# EAGLE schematic mbed 6LoWPAN Border Router HAT (EAGLE 7.6.0)

## Sheet 1 of 4
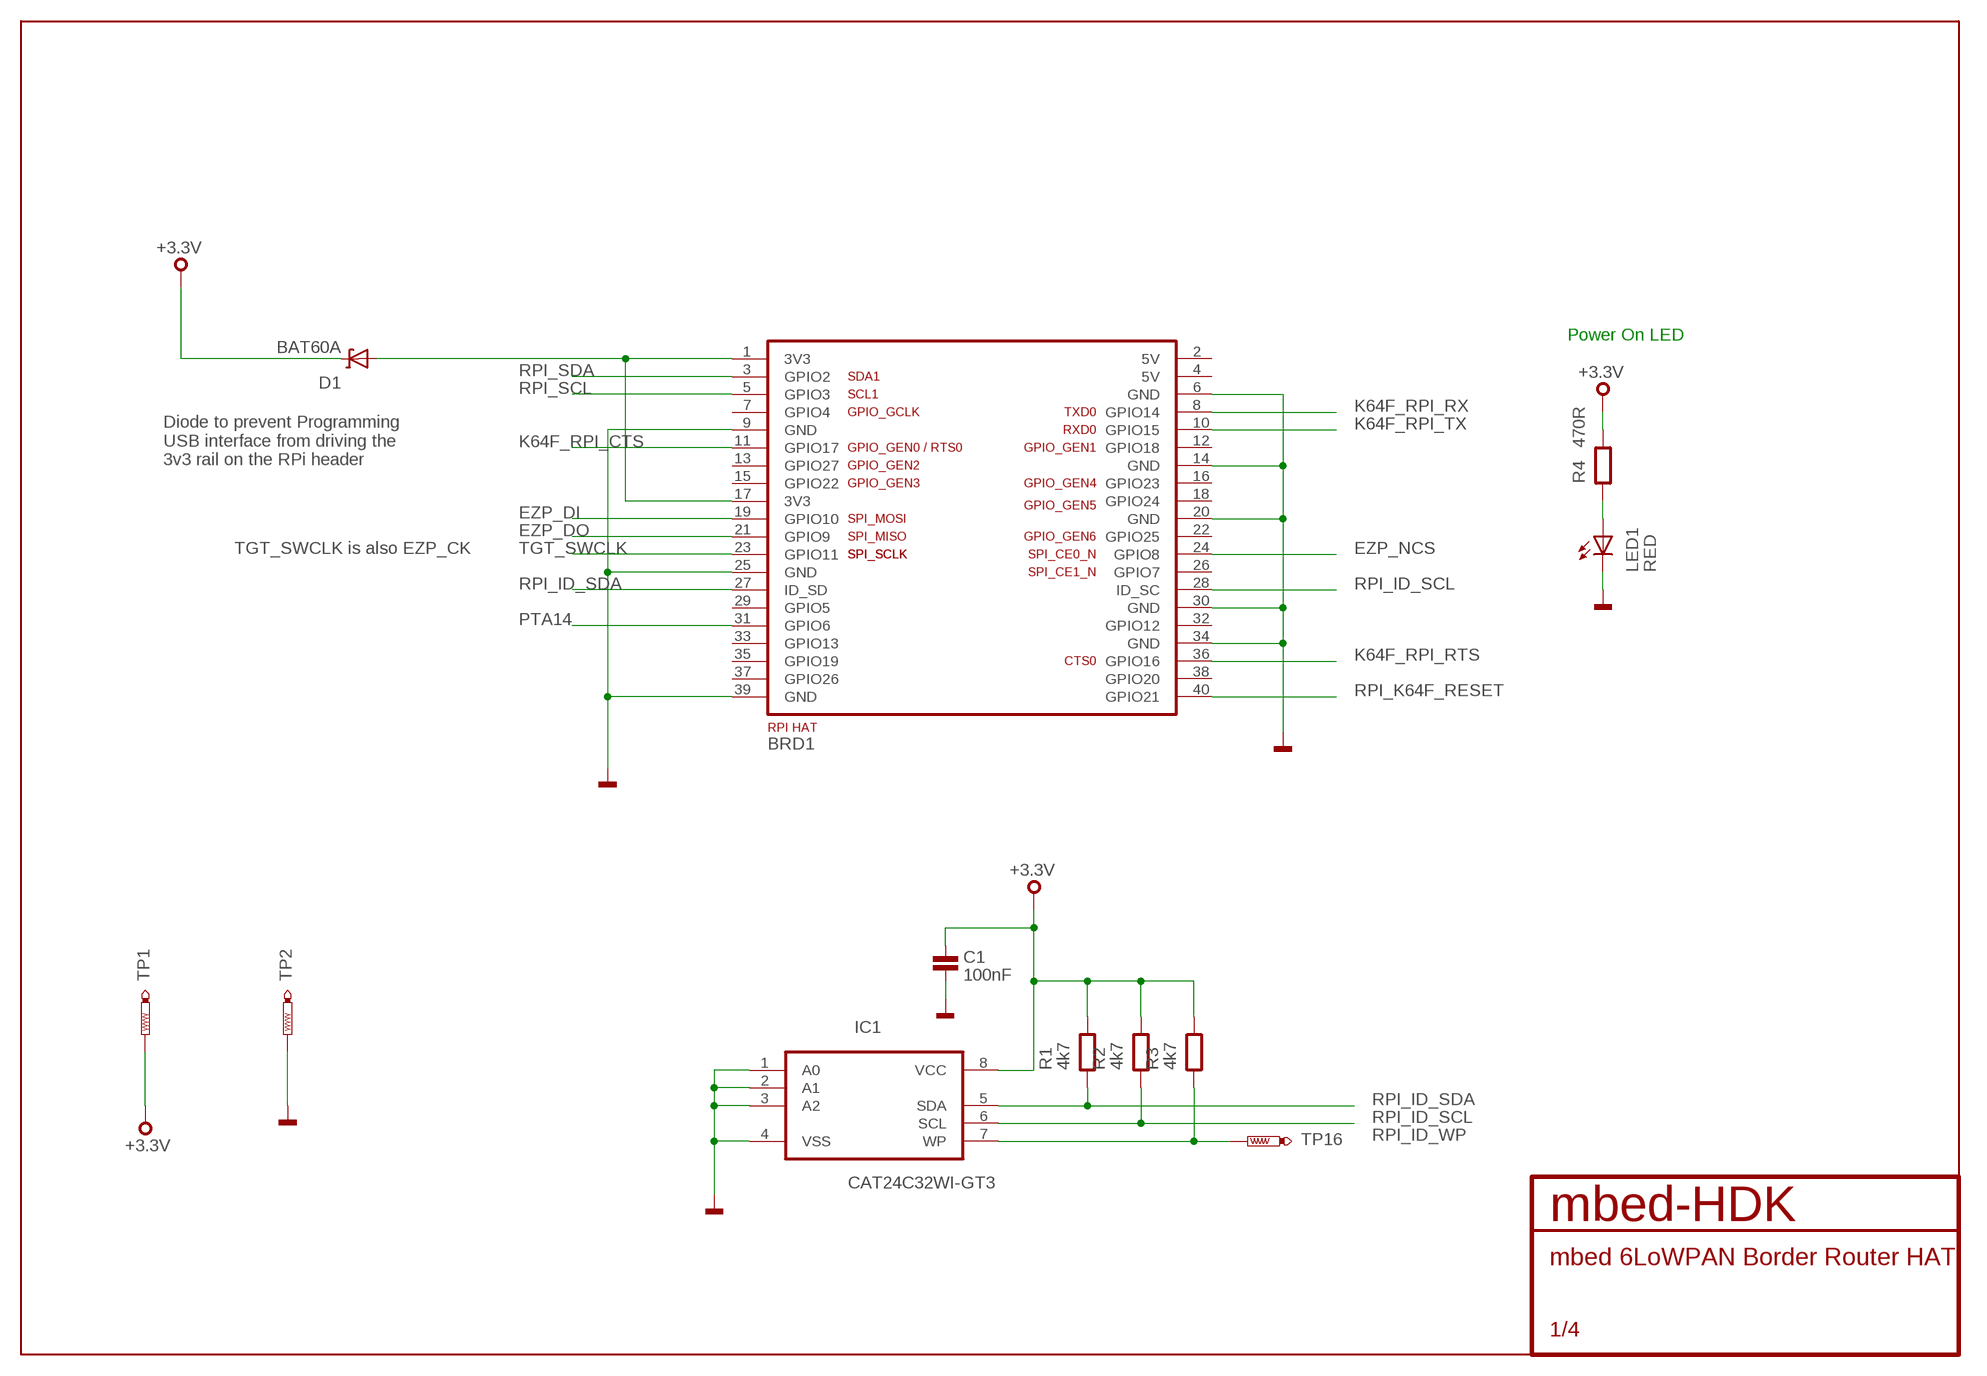
[diagram p0: schematic, sheet 1]

### Parts
BRD1  RPI-HAT  [RPI-HAT]
C1  100nF  C0402  [0402]
D1  BAT60A  [SOD323]
IC1  CAT24C32WI-GT3  [SOIC127P600X175-8N]
LED1  RED  LED0603  [CHIPLED_0603]
R1  4k7  R0402  [0402]
R2  4k7  R0402  [0402]
R3  4k7  R0402  [0402]
R4  470R  R0402  [0402]
TP1  TEST-POINT-50R-PTH  [TP50-PTH]
TP2  TEST-POINT-50R-PTH  [TP50-PTH]
TP16  TEST-POINT-50R-PTH  [TP50-PTH]

### Nets
+3.3V: C1.1 D1.K IC1.8(VCC) R1.2 R2.2 R3.2 R4.2 TP1.TP ; also sheet 2,3,4
EZP_DI: BRD1.19(GPIO10) ; also sheet 2
EZP_DO: BRD1.21(GPIO9) ; also sheet 2
EZP_NCS: BRD1.24(GPIO8) ; also sheet 2
GND: BRD1.6(GND) BRD1.9(GND) BRD1.14(GND) BRD1.20(GND) BRD1.25(GND) BRD1.30(GND) BRD1.34(GND) BRD1.39(GND) C1.2 IC1.1(A0) IC1.2(A1) IC1.3(A2) IC1.4(VSS) LED1.C TP2.TP ; also sheet 2,3,4
K64F_RPI_CTS: BRD1.11(GPIO17) ; also sheet 2
K64F_RPI_RTS: BRD1.36(GPIO16) ; also sheet 2
K64F_RPI_RX: BRD1.8(GPIO14) ; also sheet 2
K64F_RPI_TX: BRD1.10(GPIO15) ; also sheet 2
N$1: BRD1.1(3V3) BRD1.17(3V3) D1.A
N$17: LED1.A R4.1
PTA14: BRD1.31(GPIO6) ; also sheet 2
RPI_ID_SCL: BRD1.28(ID_SC) IC1.6(SCL) R2.1
RPI_ID_SDA: BRD1.27(ID_SD) IC1.5(SDA) R1.1
RPI_ID_WP: IC1.7(WP) R3.1 TP16.TP
RPI_K64F_RESET: BRD1.40(GPIO21) ; also sheet 2
RPI_SCL: BRD1.5(GPIO3) ; also sheet 2
RPI_SDA: BRD1.3(GPIO2) ; also sheet 2
TGT_SWCLK: BRD1.23(GPIO11) ; also sheet 2,4
Unconnected: BRD1.2(5V) BRD1.4(5V) BRD1.7(GPIO4) BRD1.12(GPIO18) BRD1.13(GPIO27) BRD1.15(GPIO22) BRD1.16(GPIO23) BRD1.18(GPIO24) BRD1.22(GPIO25) BRD1.26(GPIO7) BRD1.29(GPIO5) BRD1.32(GPIO12) BRD1.33(GPIO13) BRD1.35(GPIO19) BRD1.37(GPIO26) BRD1.38(GPIO20)

### Notes on the sheet
- Power On LED
- Diode to prevent Programming
  USB interface from driving the
  3v3 rail on the RPi header
- TGT_SWCLK is also EZP_CK

## Sheet 2 of 4
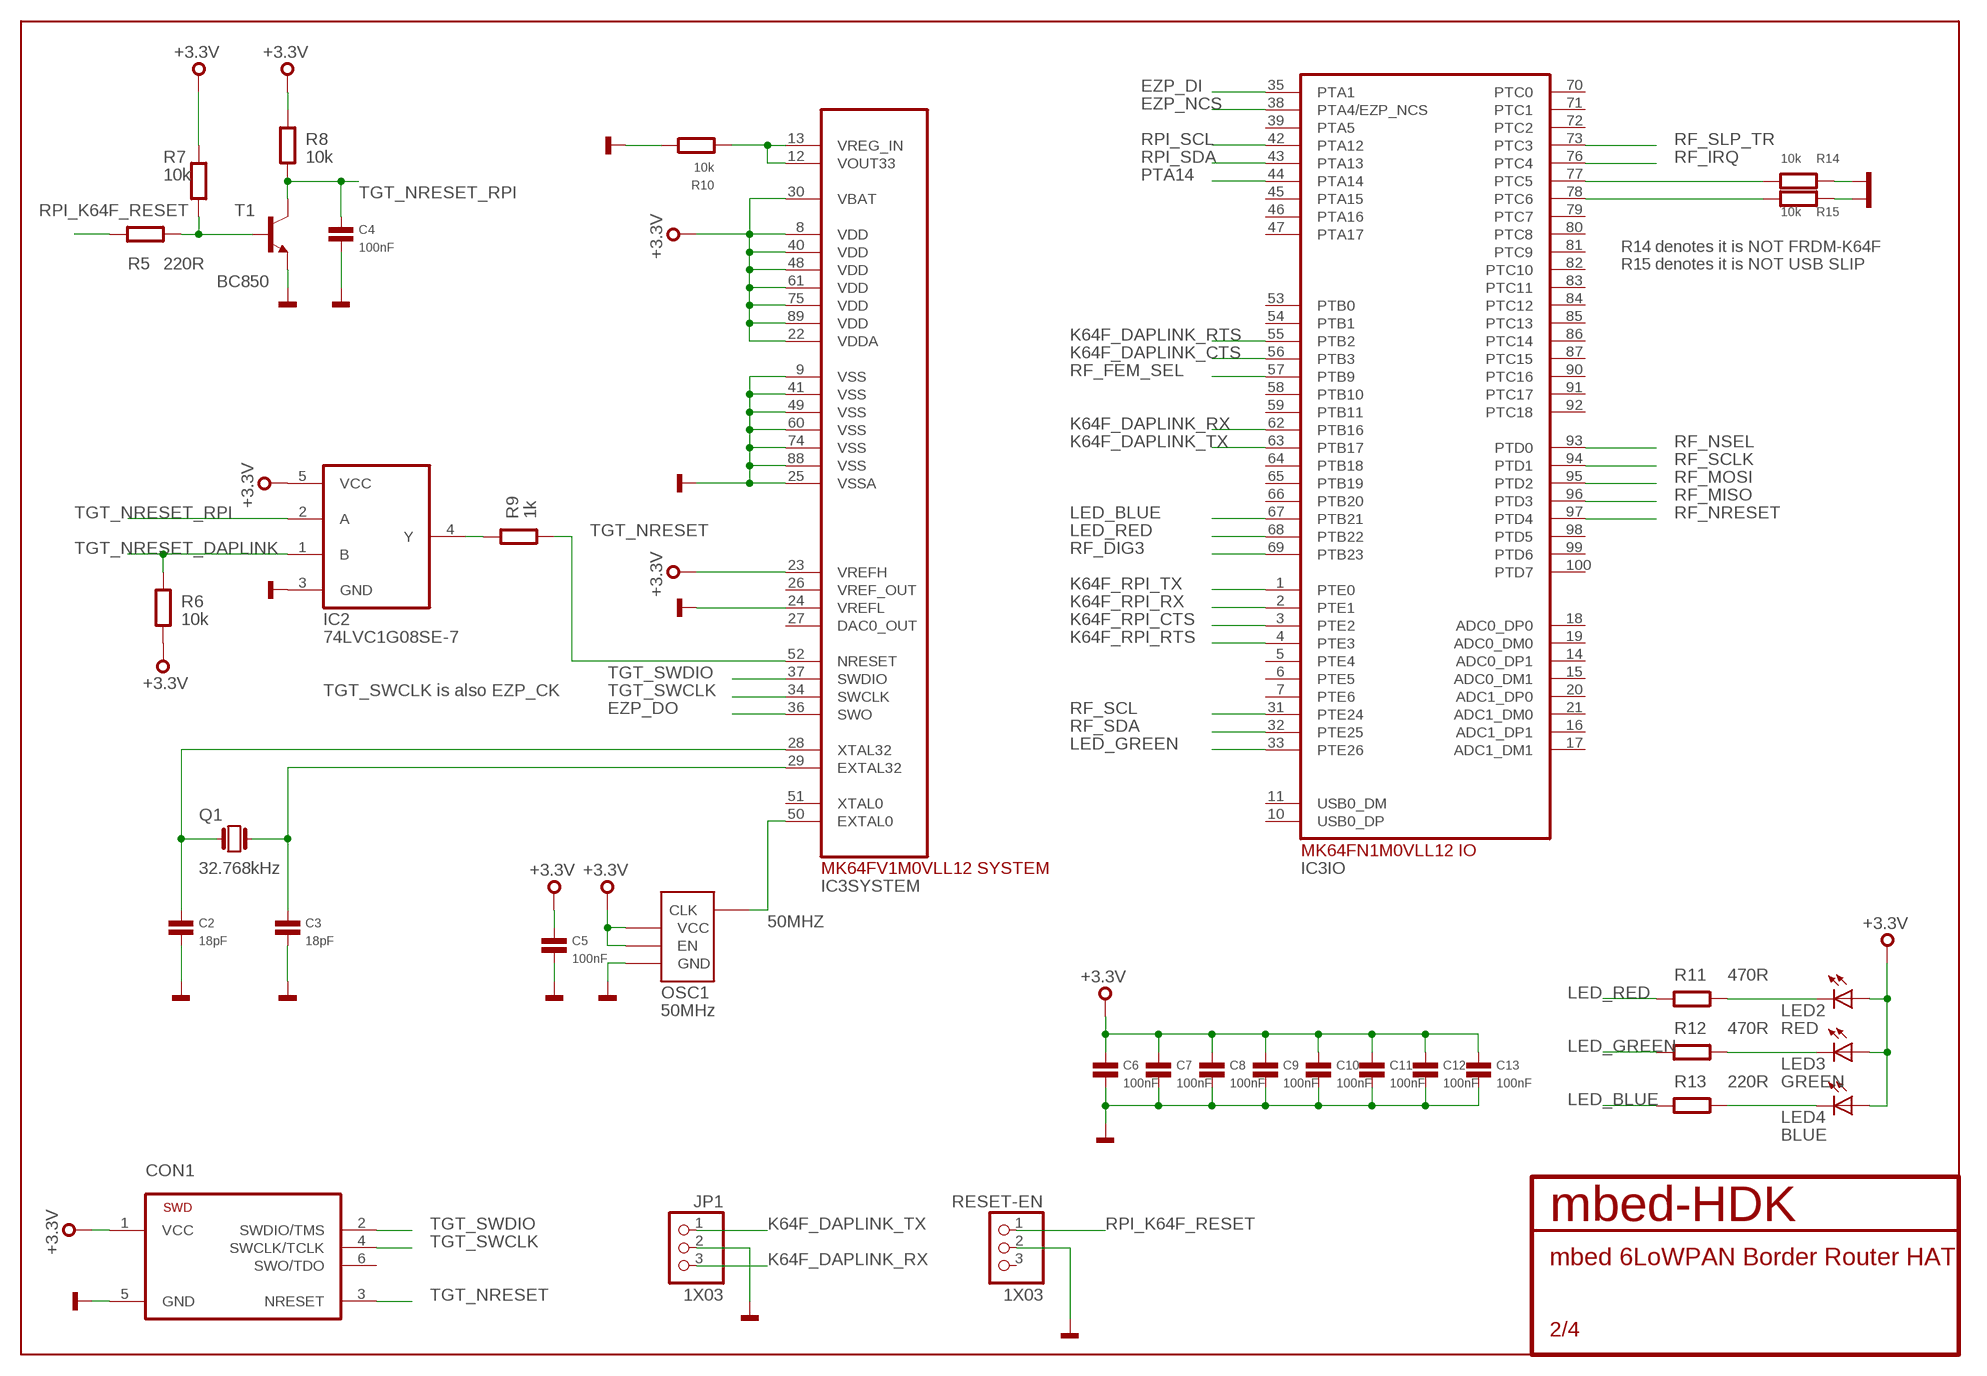
[diagram p1: schematic, sheet 2]

### Parts
C2  18pF  C0402  [0402]
C3  18pF  C0402  [0402]
C4  100nF  C0402  [0402]
C5  100nF  C0402  [0402]
C6  100nF  C0402  [0402]
C7  100nF  C0402  [0402]
C8  100nF  C0402  [0402]
C9  100nF  C0402  [0402]
C10  100nF  C0402  [0402]
C11  100nF  C0402  [0402]
C12  100nF  C0402  [0402]
C13  100nF  C0402  [0402]
CON1  TC2030-CTX-NL  [TC2030-CTX-NL]
IC2  74LVC1G08SE-7  74LVC1GXX  [SOT353]
IC3  MK64FN1M0VLL12  [LQFP100]
JP1  1X03  PINHD-1X3  [1X03]
LED2  RED  LED0603  [CHIPLED_0603]
LED3  GREEN  LED0603  [CHIPLED_0603]
LED4  BLUE  LED0603  [CHIPLED_0603]
OSC1  50MHz  OSCILLATOR3.2X2.5  [3.2X.2.5]
Q1  32.768kHz  Q_FC135  [FC135]
R5  220R  R0402  [0402]
R6  10k  R0402  [0402]
R7  10k  R0402  [0402]
R8  10k  R0402  [0402]
R9  1k  R0402  [0402]
R10  10k  R0402  [0402]
R11  470R  R0402  [0402]
R12  470R  R0402  [0402]
R13  220R  R0402  [0402]
R14  10k  R0402  [0402]
R15  10k  R0402  [0402]
RESET-EN  1X03  PINHD-1X3  [1X03]
T1  BC850  [SOT23]

### Nets
50MHZ: IC3.50(SYSTEM:EXTAL0) OSC1.P$3(CLK)
+3.3V: C5.1 C6.1 C7.1 C8.1 C9.1 C10.1 C11.1 C12.1 C13.1 CON1.1(VCC) IC2.5(VCC) IC3.8(SYSTEM:VDD) IC3.22(SYSTEM:VDDA) IC3.23(SYSTEM:VREFH) IC3.30(SYSTEM:VBAT) IC3.40(SYSTEM:VDD) IC3.48(SYSTEM:VDD) IC3.61(SYSTEM:VDD) IC3.75(SYSTEM:VDD) IC3.89(SYSTEM:VDD) LED2.A LED3.A LED4.A OSC1.P$1(EN) OSC1.P$4(VCC) R6.1 R7.1 R8.2 ; also sheet 1,3,4
EZP_DI: IC3.35(IO:PTA1) ; also sheet 1
EZP_DO: IC3.36(SYSTEM:SWO) ; also sheet 1
EZP_NCS: IC3.38(IO:PTA4/EZP_NCS) ; also sheet 1
GND: C2.2 C3.2 C4.2 C5.2 C6.2 C7.2 C8.2 C9.2 C10.2 C11.2 C12.2 C13.2 CON1.5(GND) IC2.3(GND) IC3.9(SYSTEM:VSS) IC3.24(SYSTEM:VREFL) IC3.25(SYSTEM:VSSA) IC3.41(SYSTEM:VSS) IC3.49(SYSTEM:VSS) IC3.60(SYSTEM:VSS) IC3.74(SYSTEM:VSS) IC3.88(SYSTEM:VSS) JP1.2 OSC1.P$2(GND) R10.2 R14.2 R15.2 RESET-EN.2 T1.2(E) ; also sheet 1,3,4
K64F_DAPLINK_CTS: IC3.56(IO:PTB3) ; also sheet 4
K64F_DAPLINK_RTS: IC3.55(IO:PTB2) ; also sheet 4
K64F_DAPLINK_RX: IC3.62(IO:PTB16) JP1.3 ; also sheet 4
K64F_DAPLINK_TX: IC3.63(IO:PTB17) JP1.1 ; also sheet 4
K64F_RPI_CTS: IC3.3(IO:PTE2) ; also sheet 1
K64F_RPI_RTS: IC3.4(IO:PTE3) ; also sheet 1
K64F_RPI_RX: IC3.2(IO:PTE1) ; also sheet 1
K64F_RPI_TX: IC3.1(IO:PTE0) ; also sheet 1
LED_BLUE: IC3.67(IO:PTB21) R13.1
LED_GREEN: IC3.33(IO:PTE26) R12.1
LED_RED: IC3.68(IO:PTB22) R11.1
N$2: C2.1 IC3.28(SYSTEM:XTAL32) Q1.X1
N$3: C3.1 IC3.29(SYSTEM:EXTAL32) Q1.X2
N$4: IC3.77(IO:PTC5) R14.1
N$6: IC3.12(SYSTEM:VOUT33) IC3.13(SYSTEM:VREG_IN) R10.1
N$8: LED2.C R11.2
N$9: LED3.C R12.2
N$10: LED4.C R13.2
N$14: R5.1 R7.2 T1.1(B)
N$15: IC2.4(Y) R9.2
N$16: IC3.78(IO:PTC6) R15.1
PTA14: IC3.44(IO:PTA14) ; also sheet 1
RF_DIG3: IC3.69(IO:PTB23) ; also sheet 3
RF_FEM_SEL: IC3.57(IO:PTB9) ; also sheet 3
RF_IRQ: IC3.76(IO:PTC4) ; also sheet 3
RF_MISO: IC3.96(IO:PTD3) ; also sheet 3
RF_MOSI: IC3.95(IO:PTD2) ; also sheet 3
RF_NRESET: IC3.97(IO:PTD4) ; also sheet 3
RF_NSEL: IC3.93(IO:PTD0) ; also sheet 3
RF_SCL: IC3.31(IO:PTE24) ; also sheet 3
RF_SCLK: IC3.94(IO:PTD1) ; also sheet 3
RF_SDA: IC3.32(IO:PTE25) ; also sheet 3
RF_SLP_TR: IC3.73(IO:PTC3) ; also sheet 3
RPI_K64F_RESET: R5.2 RESET-EN.1 ; also sheet 1
RPI_SCL: IC3.42(IO:PTA12) ; also sheet 1
RPI_SDA: IC3.43(IO:PTA13) ; also sheet 1
TGT_NRESET: CON1.3(NRESET) IC3.52(SYSTEM:NRESET) R9.1 ; also sheet 4
TGT_NRESET_DAPLINK: IC2.1(B) R6.2 ; also sheet 4
TGT_NRESET_RPI: C4.1 IC2.2(A) R8.1 T1.3(C)
TGT_SWCLK: CON1.4(SWCLK/TCLK) IC3.34(SYSTEM:SWCLK) ; also sheet 1,4
TGT_SWDIO: CON1.2(SWDIO/TMS) IC3.37(SYSTEM:SWDIO) ; also sheet 4
Unconnected: CON1.6(SWO/TDO) IC3.5(IO:PTE4) IC3.6(IO:PTE5) IC3.7(IO:PTE6) IC3.10(IO:USB0_DP) IC3.11(IO:USB0_DM) IC3.14(IO:ADC0_DP1) IC3.15(IO:ADC0_DM1) IC3.16(IO:ADC1_DP1) IC3.17(IO:ADC1_DM1) IC3.18(IO:ADC0_DP0) IC3.19(IO:ADC0_DM0) IC3.20(IO:ADC1_DP0) IC3.21(IO:ADC1_DM0) IC3.26(SYSTEM:VREF_OUT) IC3.27(SYSTEM:DAC0_OUT) IC3.39(IO:PTA5) IC3.45(IO:PTA15) IC3.46(IO:PTA16) IC3.47(IO:PTA17) IC3.51(SYSTEM:XTAL0) IC3.53(IO:PTB0) IC3.54(IO:PTB1) IC3.58(IO:PTB10) IC3.59(IO:PTB11) IC3.64(IO:PTB18) IC3.65(IO:PTB19) IC3.66(IO:PTB20) IC3.70(IO:PTC0) IC3.71(IO:PTC1) IC3.72(IO:PTC2) IC3.79(IO:PTC7) IC3.80(IO:PTC8) IC3.81(IO:PTC9) IC3.82(IO:PTC10) IC3.83(IO:PTC11) IC3.84(IO:PTC12) IC3.85(IO:PTC13) IC3.86(IO:PTC14) IC3.87(IO:PTC15) IC3.90(IO:PTC16) IC3.91(IO:PTC17) IC3.92(IO:PTC18) IC3.98(IO:PTD5) IC3.99(IO:PTD6) IC3.100(IO:PTD7) RESET-EN.3

### Notes on the sheet
- R14 denotes it is NOT FRDM-K64F
  R15 denotes it is NOT USB SLIP
- TGT_SWCLK is also EZP_CK

## Sheet 3 of 4
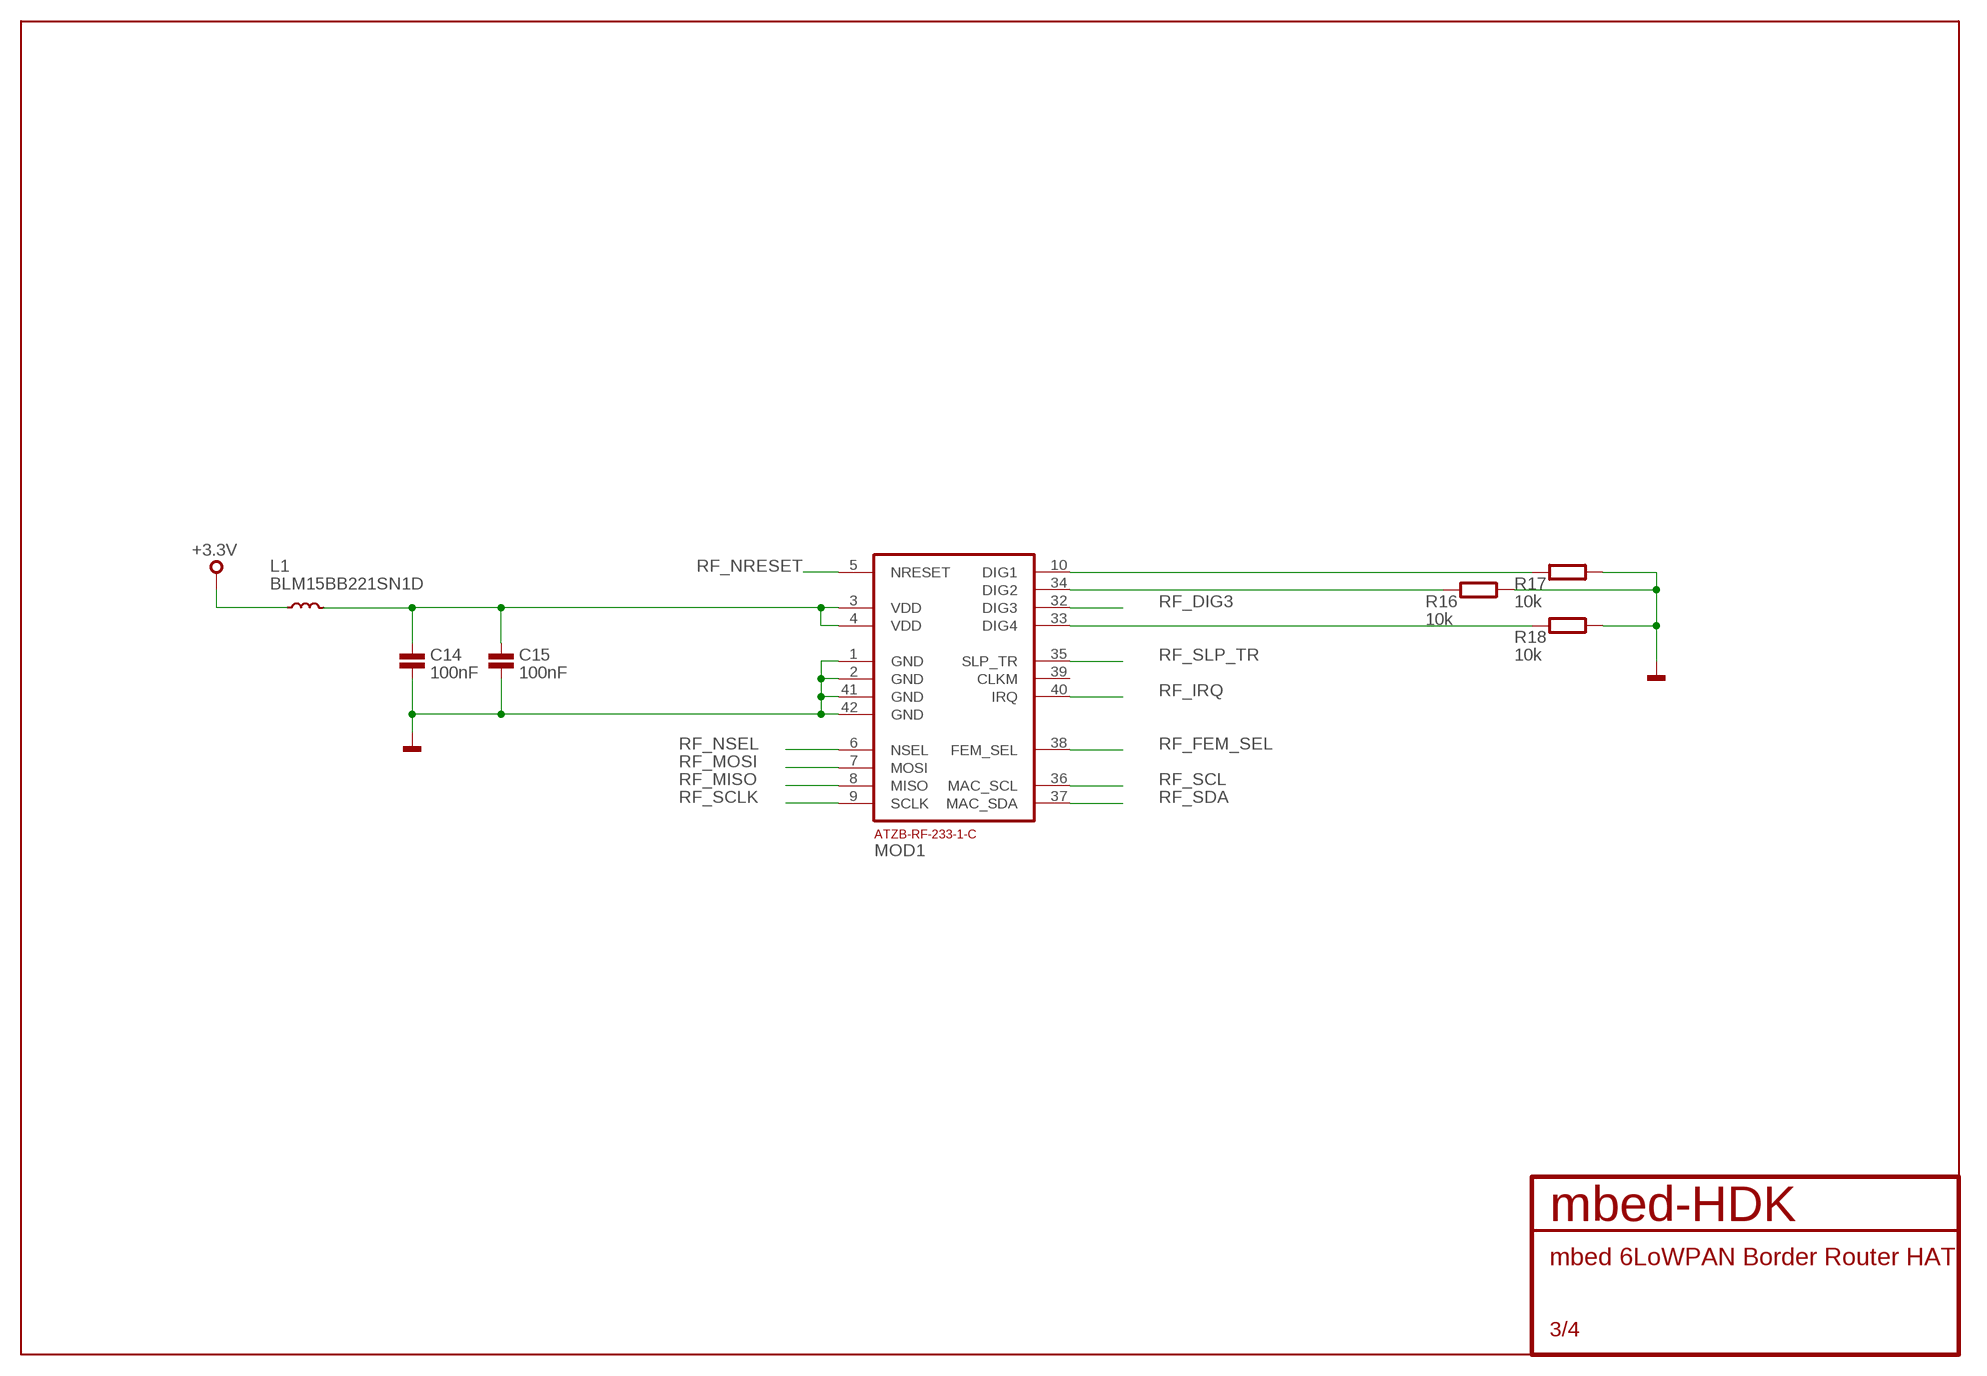
[diagram p2: schematic, sheet 3]

### Parts
C14  100nF  C0402  [0402]
C15  100nF  C0402  [0402]
L1  BLM15BB221SN1D  L0402  [0402]
MOD1  ATZB-RF-233-1-C  [ATZB-RF-233-1-C]
R16  10k  R0402  [0402]
R17  10k  R0402  [0402]
R18  10k  R0402  [0402]

### Nets
+3.3V: L1.1 ; also sheet 1,2,4
GND: C14.2 C15.2 MOD1.1(GND) MOD1.2(GND) MOD1.41(GND) MOD1.42(GND) R16.2 R17.2 R18.1 ; also sheet 1,2,4
N$7: MOD1.10(DIG1) R17.1
N$11: MOD1.34(DIG2) R16.1
N$12: MOD1.33(DIG4) R18.2
N$13: C14.1 C15.1 L1.2 MOD1.3(VDD) MOD1.4(VDD)
RF_DIG3: MOD1.32(DIG3) ; also sheet 2
RF_FEM_SEL: MOD1.38(FEM_SEL) ; also sheet 2
RF_IRQ: MOD1.40(IRQ) ; also sheet 2
RF_MISO: MOD1.8(MISO) ; also sheet 2
RF_MOSI: MOD1.7(MOSI) ; also sheet 2
RF_NRESET: MOD1.5(NRESET) ; also sheet 2
RF_NSEL: MOD1.6(NSEL) ; also sheet 2
RF_SCL: MOD1.36(MAC_SCL) ; also sheet 2
RF_SCLK: MOD1.9(SCLK) ; also sheet 2
RF_SDA: MOD1.37(MAC_SDA) ; also sheet 2
RF_SLP_TR: MOD1.35(SLP_TR) ; also sheet 2
Unconnected: MOD1.39(CLKM)

## Sheet 4 of 4
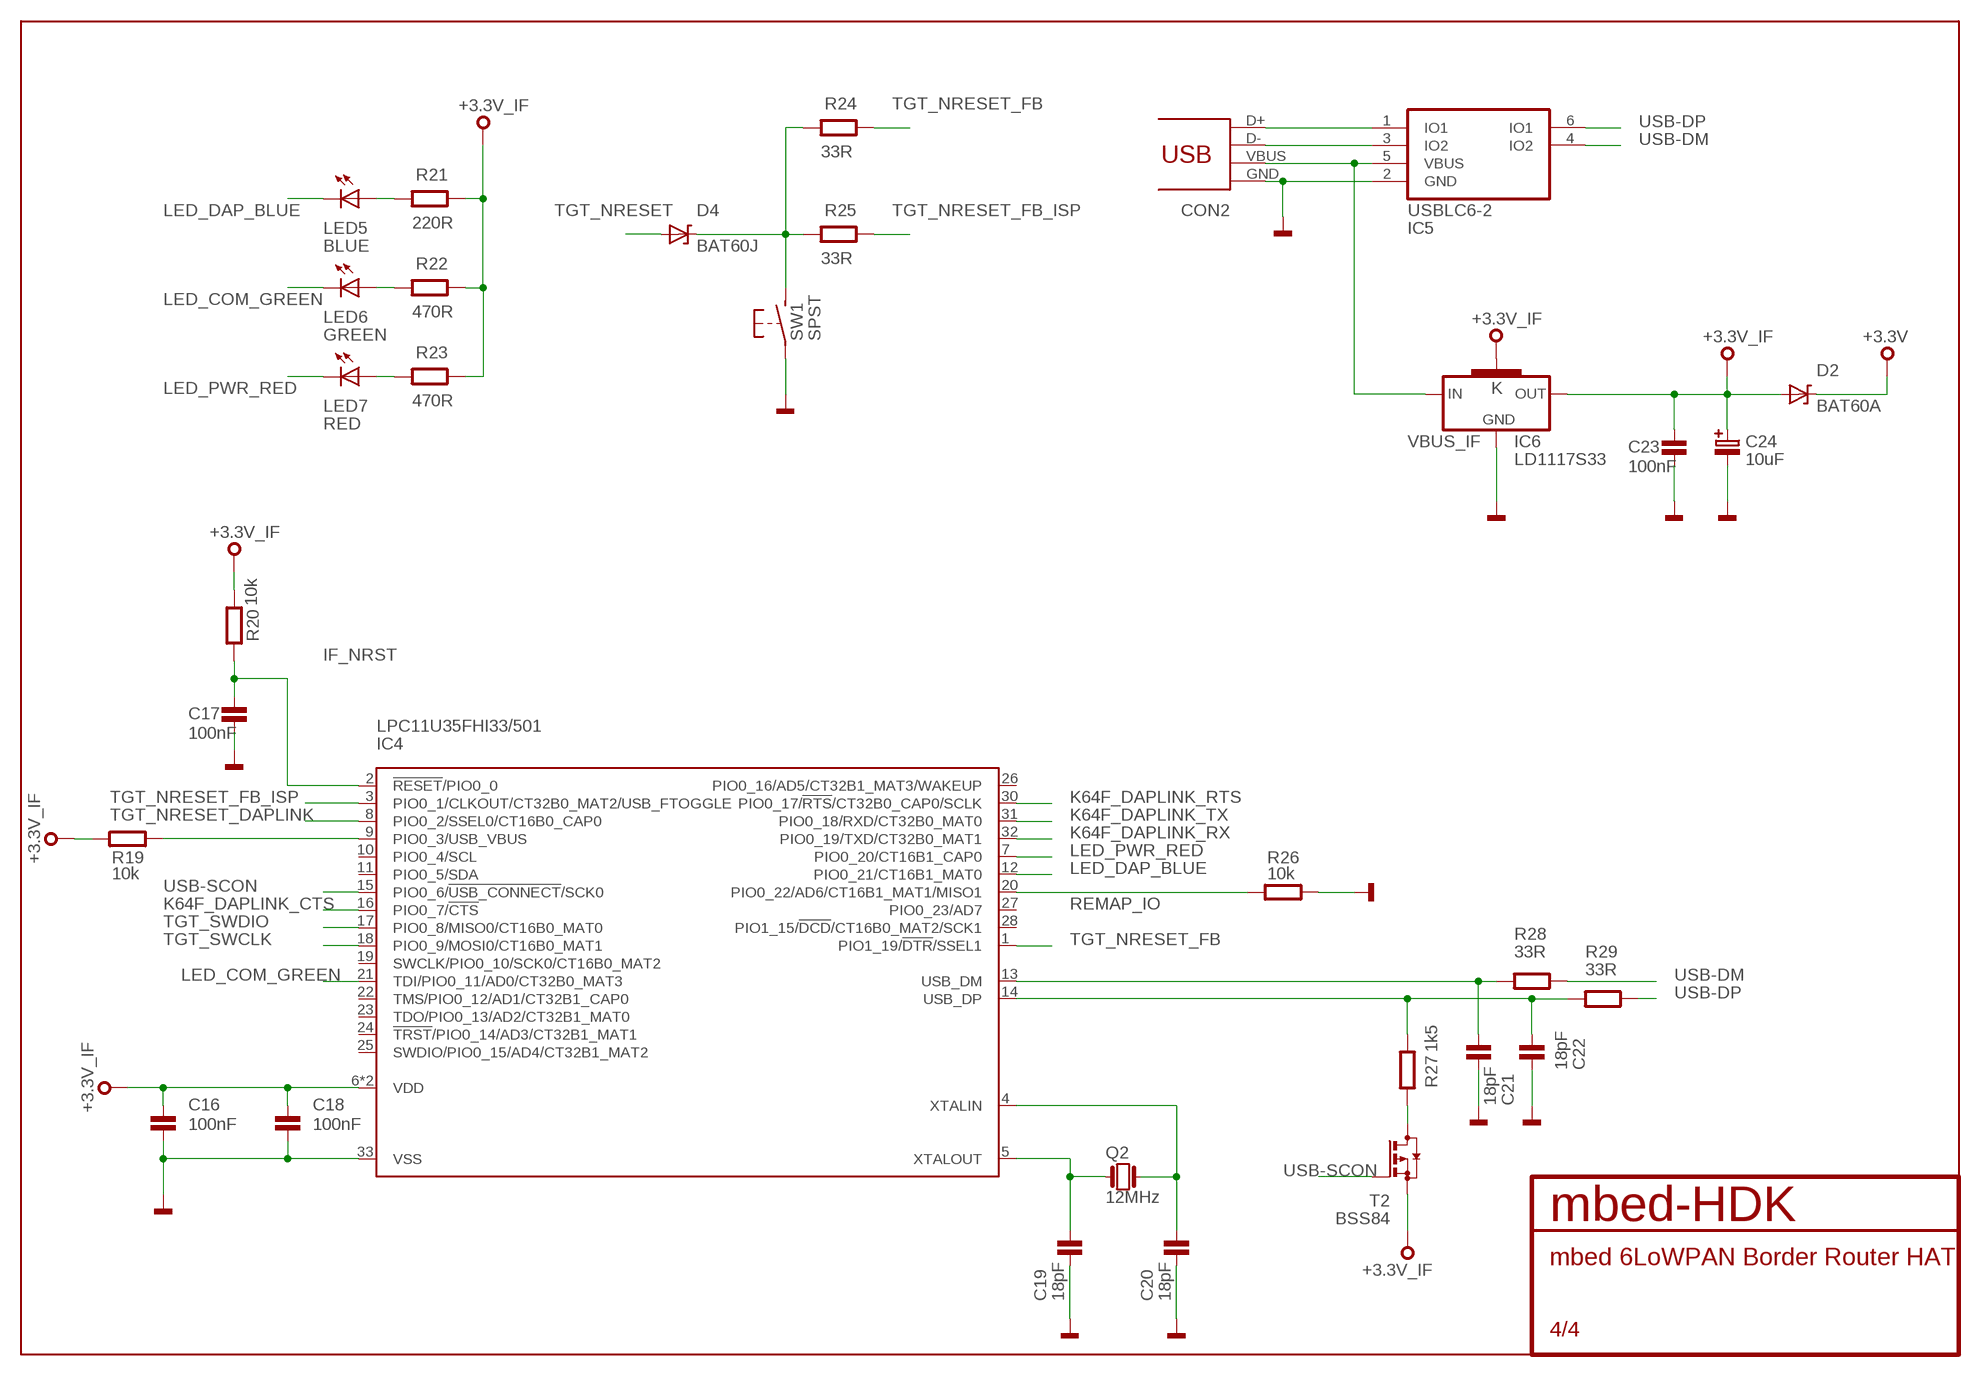
[diagram p3: schematic, sheet 4]

### Parts
C16  100nF  C0402  [0402]
C17  100nF  C0402  [0402]
C18  100nF  C0402  [0402]
C19  18pF  C0402  [0402]
C20  18pF  C0402  [0402]
C21  18pF  C0402  [0402]
C22  18pF  C0402  [0402]
C23  100nF  C0402  [0402]
C24  10uF  C-POLB  [SMC_B]
CON2  USB_MICROB  [MOLEX-47364-0001]
D2  BAT60A  [SOD323]
D4  BAT60J  [SOD323]
IC4  LPC11U35FHI33/501  [SOT617-3]
IC5  USBLC6-2SC6  [SOT23-6L]
IC6  LD1117S33  [SOT223]
LED5  BLUE  LED0603  [CHIPLED_0603]
LED6  GREEN  LED0603  [CHIPLED_0603]
LED7  RED  LED0603  [CHIPLED_0603]
Q2  12MHz  Q_3.2X2.5  [3.2X.2.5]
R19  10k  R0402  [0402]
R20  10k  R0402  [0402]
R21  220R  R0402  [0402]
R22  470R  R0402  [0402]
R23  470R  R0402  [0402]
R24  33R  R0402  [0402]
R25  33R  R0402  [0402]
R26  10k  R0402  [0402]
R27  1k5  R0402  [0402]
R28  33R  R0402  [0402]
R29  33R  R0402  [0402]
SW1  SPST  [DTSM-32S-B]
T2  BSS84  [SOT23]

### Nets
+3.3V: D2.K ; also sheet 1,2,3
+3.3V_IF: C16.1 C18.1 C23.1 C24.+ D2.A IC4.6(VDD) IC4.29(VDD) IC6.2(OUT) IC6.4(K) R19.2 R20.2 R21.1 R22.1 R23.1 T2.2(S)
D+: CON2.D+ IC5.1(IO1)
D-: CON2.D- IC5.3(IO2)
DM: C21.1 IC4.13(USB_DM) R28.2
DP: C22.1 IC4.14(USB_DP) R27.2 R29.2
GND: C16.2 C17.2 C18.2 C19.2 C20.2 C21.2 C22.2 C23.2 C24.- CON2.GND IC4.33(VSS) IC5.2(GND) IC6.1(GND) R26.1 SW1.P$1(P) ; also sheet 1,2,3
IF_NRST: C17.1 IC4.2(!RESET!/PIO0_0) R20.1
K64F_DAPLINK_CTS: IC4.16(PIO0_7/!CTS!) ; also sheet 2
K64F_DAPLINK_RTS: IC4.30(PIO0_17/!RTS!/CT32B0_CAP0/SCLK) ; also sheet 2
K64F_DAPLINK_RX: IC4.32(PIO0_19/TXD/CT32B0_MAT1) ; also sheet 2
K64F_DAPLINK_TX: IC4.31(PIO0_18/RXD/CT32B0_MAT0) ; also sheet 2
LED_COM_GREEN: IC4.21(TDI/PIO0_11/AD0/CT32B0_MAT3) LED6.C
LED_DAP_BLUE: IC4.12(PIO0_21/CT16B1_MAT0) LED5.C
LED_PWR_RED: IC4.7(PIO0_20/CT16B1_CAP0) LED7.C
N$5: D4.K R24.2 R25.2 SW1.P$2(S)
N$18: C19.1 IC4.5(XTALOUT) Q2.P$1
N$19: C20.1 IC4.4(XTALIN) Q2.P$3
N$20: IC4.9(PIO0_3/USB_VBUS) R19.1
N$23: R27.1 T2.3(D)
N$36: LED6.A R22.2
N$37: LED7.A R23.2
N$38: LED5.A R21.2
REMAP_IO: IC4.20(PIO0_22/AD6/CT16B1_MAT1/MISO1) R26.2
TGT_NRESET: D4.A ; also sheet 2
TGT_NRESET_DAPLINK: IC4.8(PIO0_2/SSEL0/CT16B0_CAP0) ; also sheet 2
TGT_NRESET_FB: IC4.1(PIO1_19/!DTR!/SSEL1) R24.1
TGT_NRESET_FB_ISP: IC4.3(PIO0_1/CLKOUT/CT32B0_MAT2/USB_FTOGGLE) R25.1
TGT_SWCLK: IC4.18(PIO0_9/MOSI0/CT16B0_MAT1) ; also sheet 1,2
TGT_SWDIO: IC4.17(PIO0_8/MISO0/CT16B0_MAT0) ; also sheet 2
USB-DM: IC5.4(IO2) R28.1
USB-DP: IC5.6(IO1) R29.1
USB-SCON: IC4.15(PIO0_6/!USB_CONNECT!/SCK0) T2.1(G)
VBUS_IF: CON2.VBUS IC5.5(VBUS) IC6.3(IN)
Unconnected: IC4.10(PIO0_4/SCL) IC4.11(PIO0_5/SDA) IC4.19(SWCLK/PIO0_10/SCK0/CT16B0_MAT2) IC4.22(TMS/PIO0_12/AD1/CT32B1_CAP0) IC4.23(TDO/PIO0_13/AD2/CT32B1_MAT0) IC4.24(!TRST!/PIO0_14/AD3/CT32B1_MAT1) IC4.25(SWDIO/PIO0_15/AD4/CT32B1_MAT2) IC4.26(PIO0_16/AD5/CT32B1_MAT3/WAKEUP) IC4.27(PIO0_23/AD7) IC4.28(PIO1_15/!DCD!/CT16B0_MAT2/SCK1)

## Library data of the parts
BRD1 = mbed-HDK:RPI-HAT
C1-C23 = mbed-HDK:C: Capacitor
C24 = mbed-HDK:C-POL: Polarised capacitor; MF: Kemet; MFN: T491B106K020AT; OC-DIGIKEY: 399-8298-1-ND; OC-MOUSER: 80-T491B106K020; OC-NEWARK: 57K1740
CON1 = mbed-HDK:TC2030-CTX: Tag-Connect In Circuit Programming & Debug Cable 6 Pin http://www.tag-connect.com
CON2 = mbed-HDK:USB: USB Connectors; MF: MOLEX; MFN: 47346-0001; OC-MOUSER: 538-47346-0001; OC-NEWARK: 1568026
D1 D2 = mbed-HDK:BAT60A: Schottky Diode BAT60A INFINEON BAT60A E6327 Small Signal Schottky Diode Lower Vfm than BAT60A Vrrm: 10 V If: 3A Vfm: 370mV Ifsm: 5A Max Temp: 85 °C; MF: Infineon; MFN: BAT60AE6327HTSA1; OC-DIGIKEY: BAT60AE6327HTSA1CT-ND; OC-MOUSER: 726-BAT60AE6327; OC-NEWARK: 85X4127
D4 = mbed-HDK:BAT60J: Schottky Diode BAT60J BAT60JFILM Small Signal Schottky Diode Higher Vfm than BAT60A Vrrm: 10 V If: 3A Vfm: 580mV Ifsm: 5A Max Temp: 150 °C; MF: STMicroelectronics; MFN: BAT60JFILM; OC-DIGIKEY: 497-3707-6-ND; OC-MOUSER: 511-BAT60JFILM; OC-NEWARK: 89K1218
IC1 = mbed-HDK:CAT24C32WI-GT3: 32-Kb I2C CMOS Serial EEPROM; MPN: CAT24C32WI-GT3; OC_FARNELL: 1718129; OC_NEWARK: 08R5414; PACKAGE: SOIC-8; SUPPLIER: CATALYST SEMICONDUCTOR
IC2 = mbed-HDK:74LVC1GXX: 74LVC1G08SE-7 LOGIC, 2 POS AND GATE, SINGLE, 2 IP, SOT353; MF: Diodes Inc.; MFN: 74LVC1G08SE-7; OC-DIGIKEY: 74LVC1G08SE-7DICT-ND; OC-MOUSER: 621-74LVC1G08SE-7; OC-NEWARK: 12T8904
IC3 = mbed-HDK:MK64FN1M0VLL12
IC4 = mbed-HDK:LPC11U35FHI33: 32-bit ARM Cortex-M0 microcontroller; up to 128 kB flash; up to 12 kB SRAM and 4 kB EEPROM; USB device; USART The LPC11U3x are a ARM Cortex-M0 based, low-cost 32-bit MCU family, designed for 8/16-bit microcontroller applications, offering performance, low power, simple instruction set and memory addressing together with reduced code size compared to existing 8/16-bit architectures. The LPC11U3x operate at CPU frequencies of up to 50 MHz. Equipped with a highly flexible and configurable Full Speed USB 2.0 device controller, the LPC11U3x brings unparalleled design flexibility and seamless integration to today’s demanding connectivity solutions. The peripheral complement of the LPC11U3x includes up to 128 kB of flash memory, up to 12 kB of SRAM data memory and 4 kB EEPROM, one Fast-mode Plus I 2 C-bus interface, one RS-485/EIA-485 USART with support for synchronous mode and smart card interface, two SSP interfaces, four general purpose counter/timers, a 10-bit ADC, and up to 54 general purpose I/O pins. AAL Eindhoven MK; FLASH: 64kB; GPIO: 26; MF: NXP Semiconductors; MFN: LPC11U35FHI33/501,; NEWARK-OC: 24W5342; OC-DIGIKEY: 568-9586-ND; OC-MOUSER: 771-LPC11U35FHI33501; SRAM: 12kB
IC5 = mbed-HDK:USBLC6-2
IC6 = mbed-HDK:LD1117S33: VOLTAGE REGULATOR SMD 3,3V
JP1 RESET-EN = mbed-HDK:PINHD-1X3: PIN HEADER
L1 = mbed-HDK:L: Inductor
LED1-LED7 = mbed-HDK:LED: SMD LED
MOD1 = mbed-HDK:ATZB-RF-233-1-C: ATMEL ZigBit Amp RF233 RF TXRX MODULE 802.15.4 CHIP ANT Rf Family: 802.15.4 Frequency: 2.4GHz Vsupply: 2-3.6V; MF: Atmel; MFN: ATZB-RF-233-1-CR; OC-DIGIKEY: ATZB-RF-233-1-CRCT-ND; OC-NEWARK: 27X8560
OSC1 = mbed-HDK:OSCILLATOR
Q1 Q2 = mbed-HDK:Q
R1-R29 = mbed-HDK:R
SW1 = mbed-HDK:SPST
T1 = mbed-HDK:BC850: NPN TRANSISTOR
T2 = mbed-HDK:BSS84: P-CHANNEL MOS FET
TP1 TP2 TP16 = mbed-HDK:TEST-POINT

## Net classes
0 default: width 0.152 mm, drill 0.305 mm, clearance 0.152 mm